# EAGLE design BT USB All SMD (EAGLE 7.6.0)
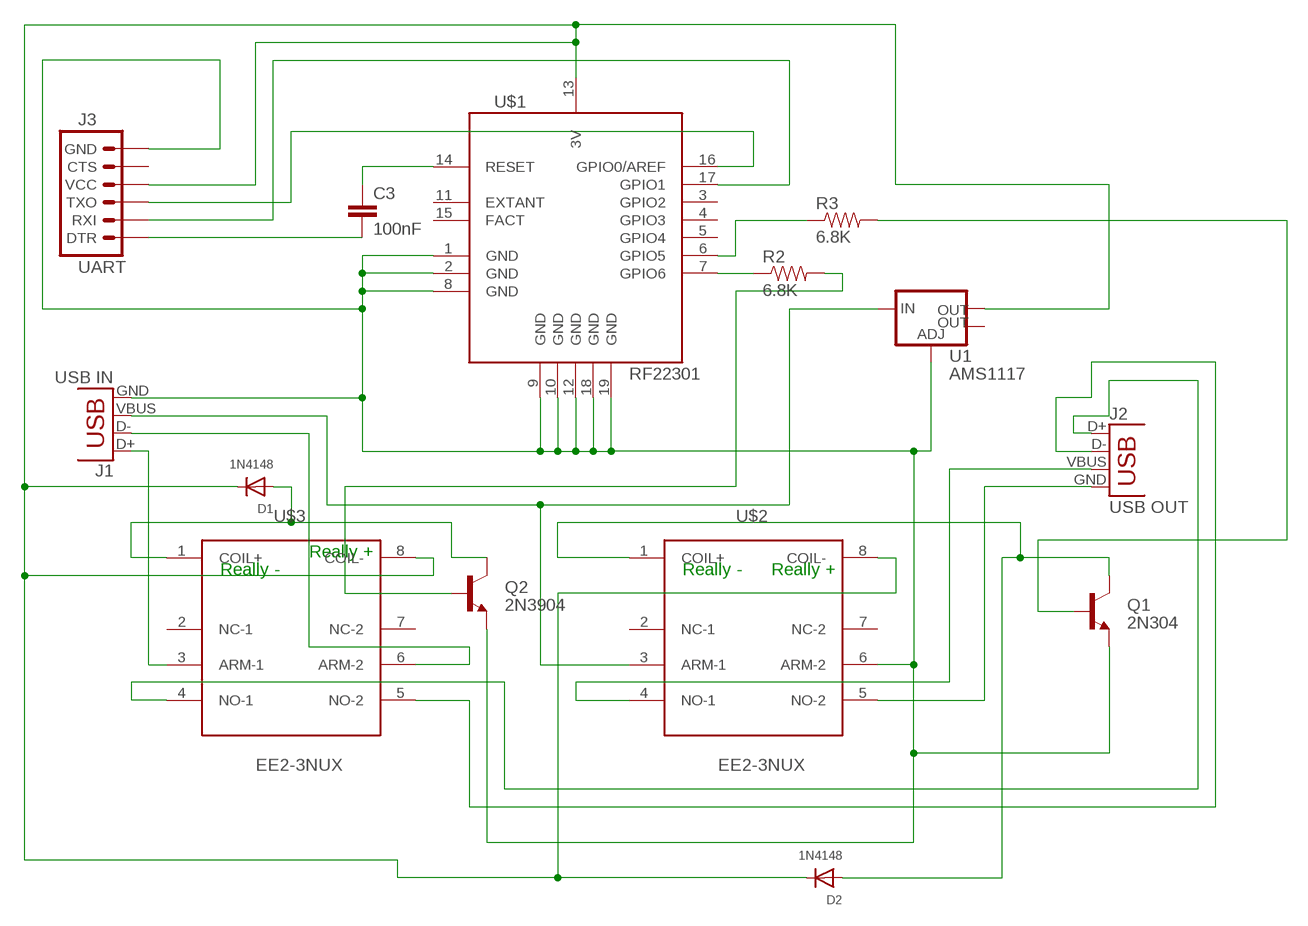
[diagram p0: schematic, sheet 1]

## Parts
C3  100nF  CAP0805  [0805]
D1  1N4148  DIODESOD-123  [SOD-123]
D2  1N4148  DIODESOD-123  [SOD-123]
J1  USB IN  USB-A-H  [USB-A-H]
J2  USB OUT  USB-A-S  [USB-A-S]
J3  UART  ARDUINO_SERIAL_PROGRAMPTH  [1X06]
Q1  2N304  TRANSISTOR_NPNMMBT5088  [SOT23-3]
Q2  2N3904  TRANSISTOR_NPNMMBT5088  [SOT23-3]
R2  6.8K  RESISTOR0805-RES  [0805]
R3  6.8K  RESISTOR0805-RES  [0805]
U1  AMS1117  V_REG_LM1117SOT223  [SOT223]
U$1  RF22301  [RFD22301]
U$2  RELAY-EE2-3NUX  [RELAY-EE2-3NUX]
U$3  RELAY-EE2-3NUX  [RELAY-EE2-3NUX]

## Nets
D_HIGH: J1.D+ U$3.3(ARM-1)
D_HIGH_OUT: J2.D+ U$3.4(NO-1)
D_LOW: J1.D- U$3.6(ARM-2)
D_LOW_OUT: J2.D- U$3.5(NO-2)
GND: J1.GND J3.6(GND) Q1.2(E) Q2.2(E) U1.1(ADJ) U$1.1(GND) U$1.2(GND) U$1.8(GND) U$1.9(GND) U$1.10(GND) U$1.12(GND) U$1.18(GND) U$1.19(GND) U$2.6(ARM-2)
GND_OUT: J2.GND U$2.5(NO-2)
N$1: D1.A Q2.3(C) U$3.1(COIL+)
N$2: D2.A Q1.3(C) U$2.1(COIL+)
N$10: C3.1 U$1.14(RESET)
N$11: C3.2 J3.1(DTR)
N$12: J3.3(TXO) U$1.16(GPIO0/AREF)
N$13: J3.2(RXI) U$1.17(GPIO1)
N$15: Q2.1(B) R2.2
N$16: R2.1 U$1.7(GPIO6)
N$17: R3.1 U$1.6(GPIO5)
N$18: Q1.1(B) R3.2
V3_3: D1.C D2.C J3.4(VCC) U1.2(OUT) U$1.13(3V) U$2.8(COIL-) U$3.8(COIL-)
V5_0: J1.VBUS U1.3(IN) U$2.3(ARM-1)
V5_0_OUT: J2.VBUS U$2.4(NO-1)
Unconnected: J3.5(CTS) U1.4(OUT) U$1.3(GPIO2) U$1.4(GPIO3) U$1.5(GPIO4) U$1.11(EXTANT) U$1.15(FACT) U$2.2(NC-1) U$2.7(NC-2) U$3.2(NC-1) U$3.7(NC-2)

## Notes on the sheet
- Really +
- Really - | Really - | Really +

## Library data of the parts
C3 = SparkFun-Capacitors:CAP: Capacitor Standard 0603 ceramic capacitor, and 0.1" leaded capacitor.
D1 D2 = adafruit:DIODE: Diode SMADIODE - SMA Surface Mount Package 20V 1A Schottky Diode Digikey: 641-1014-6-ND DO-1N4148 - Through Hole Small Current Diode SOD-123 20V 1 A (.5mV Vf) Schottky Diode - Digikey: MBRX120TPMSCT-ND SOD-323 10V 570mA (.38mV Vf, 3ns) Schottky Diode - Digikey: ZLLS410CT-ND SOD-523 30V 30mA Schottky Diode (RB751S-40TE61) - Digikey: RB751S-40TE61CT-ND SOT23-R/W - SOT23 Package (R = Solder Paste/Reflow Ovens, W = Hand-Soldering) BAT54Film 40V 300mA - Digikey: 497-7162-1-ND
J1 = SparkFun-Connectors:USB: USB Connectors USB-B-PTH is fully proven SKU : PRT-00139/CONN-08278 USB-miniB is fully proven SKU : PRT-00587 USB-A-PCB is untested. USB-A-H is throughly reviewed, but untested. Spark Fun Electronics SKU : PRT-00437 USB-B-SMT is throughly reviewed, but untested. Needs silkscreen touching up. USB-A-S has not been used/tested USB-MB-H has not been used/tested USB-MICROB has been used. CONN-09505; PROD_ID: CONN-08367
J2 = SparkFun-Connectors:USB: USB Connectors USB-B-PTH is fully proven SKU : PRT-00139/CONN-08278 USB-miniB is fully proven SKU : PRT-00587 USB-A-PCB is untested. USB-A-H is throughly reviewed, but untested. Spark Fun Electronics SKU : PRT-00437 USB-B-SMT is throughly reviewed, but untested. Needs silkscreen touching up. USB-A-S has not been used/tested USB-MB-H has not been used/tested USB-MICROB has been used. CONN-09505
J3 = SparkFun-Connectors:ARDUINO_SERIAL_PROGRAM: FTDI connector footprints
Q1 Q2 = SparkFun-DiscreteSemi:TRANSISTOR_NPN: Generic NPN BJT MMBT2222A - TRANS-08049 (SOT-23, 1A 40V) MPSA42 - TRANS-09116 (SOT-23, 500mA 300V) MMBT5088LT1G - TRANS-11160 (SOT-23, 50 mA 30V) BC547 - COM-08928 <http://www.sparkfun.com/products/8928> (TO-92 45V 100mA) (1.Collector 2.Base 3.Emitter) 2N3904 - COM-00521 <http://www.sparkfun.com/products/521> (TO-92 40V 200mA) (1.Emitter 2.Base 3.Collector) P2N2222A - COM-12852 <http://www.sparkfun.com/products/12852> (TO-92 40V 600mA) (1.Collector 2.Base 3.Emitter); PROD_ID: TRANS-11160; VALUE: MMBT5088
R2 = SparkFun-Resistors:RESISTOR: Resistor Basic schematic elements and footprints for 0603, 1206, and PTH resistors.
R3 = SparkFun-Passives:RESISTOR: Resistor Basic schematic elements and footprints for 0603, 1206, and PTH resistors.
U1 = SparkFun-PowerIC:V_REG_LM1117: Voltage Regulator LM1117 Standard adjustable voltage regulator but in SMD form. Spark Fun Electronics SKU : COM-00595; PROD_ID: VREG-08170
U$1 = GeekAmmo:RF22301: RFD22301 RFDuino Bluetooth 4.0 Low Energy BLE RF Module With Built-In ARM Cortex M0 Microconroller Hi performance, professional grade Bluetooth 4.0 Low Energy radio transceiver with built-in ARM Cortex M0 microcontroller that can be programmed using the simple-to-use Arduino IDE using RFduino extensions. Built-in user application microcontroller with ADC, I2C, SPI, UART and GPIO. http://www.rfduino.com/
U$2 U$3 = relay-ee2-3nux:RELAY-EE2-3NUX: DESCRIPTION NEC TOKIN EC2/EE2 relay is a standard miniature signal relay, compact and slim. FEATURES □Compact and light weight □FCC (1500 V) and Telcordia (2500 V) surge capacity □UL recognized and CSA certiﬁ ed. □Low power consumption (100-200 mW) □ND type (High insulation) conform to supplement insulation for EN60950 □NKX type (High breakdown voltage) can withstand 1.5KVAC at open contacts APPLICATIONS Electronic switching systems, PBX, Terminal equipment, Telephone system

## Board
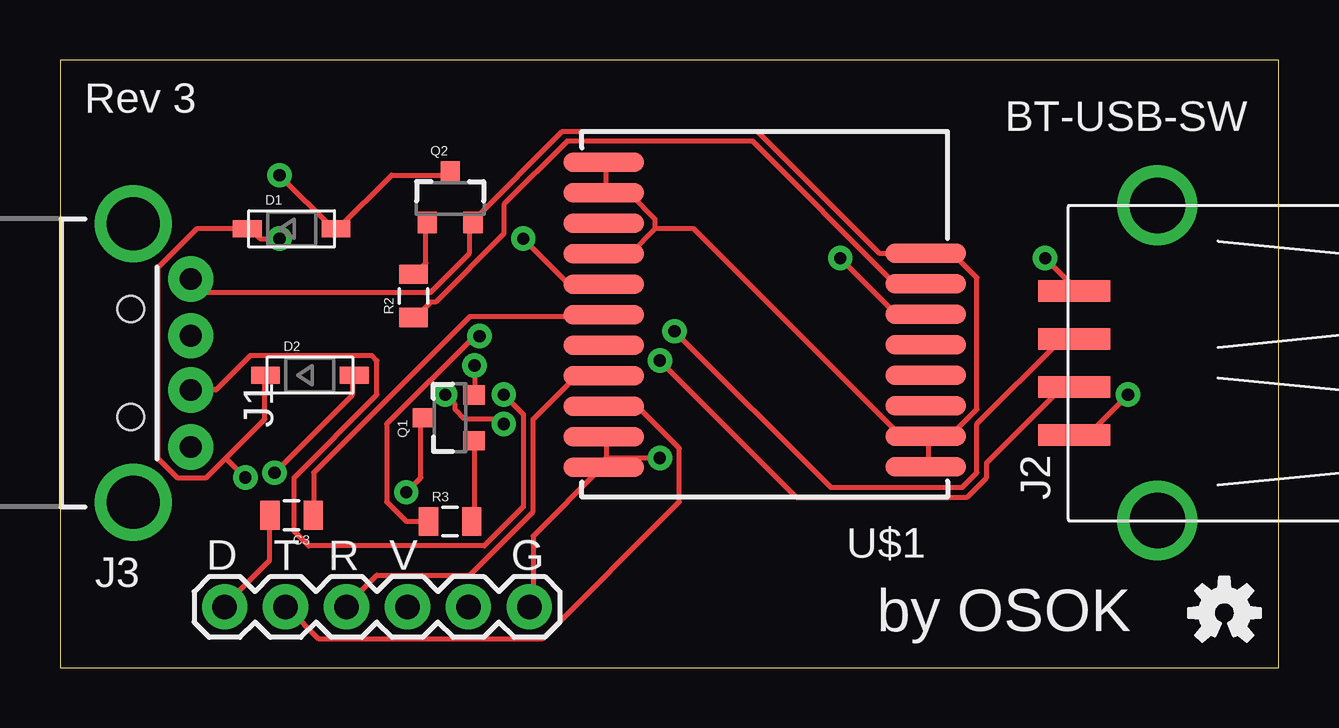
[diagram p1: board, top side]
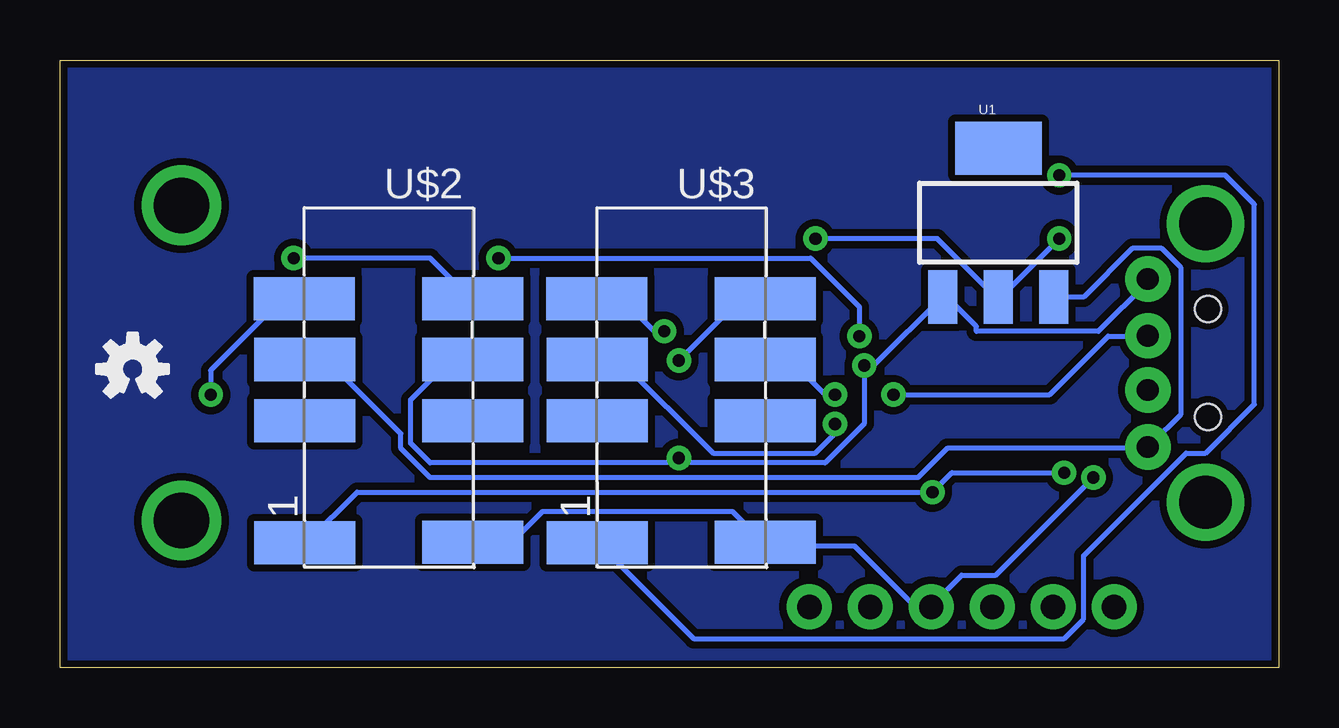
[diagram p2: board, bottom side, seen from below]

Size 50.78 x 25.32 mm. Coordinates in mm from the lower left corner, seen from the top.
Outline: 0,0 50.78,0 50.78,25.32 0,25.32 0,0
Copper layers (1*16): Top 0.035mm / dielectric 1.5mm / Bottom 0.035mm
Design rules "SparkFun": minimum track width 8mil, minimum drill 20mil, track to track 8mil, track to pad 8mil, pad to pad 8mil, via to via 8mil, smd to smd 8mil, copper to edge 10mil, drill to drill 8mil, minimum pad ring 12mil, minimum via ring 10mil, stop-mask expansion 4mil, vias tented up to drill 25mil, thermal gap 10mil

### Footprints (pad centres in the part's own frame; a part is rotated, then mirrored left to right if it is on the bottom)
0805 = smd 0.8 x 1.2: 1 -0.9,0; 2 0.9,0
SOD-123 = smd 1.2 x 0.7: A 1.85,0; C -1.85,0
USB-A-H = drill 0.914 pad 1.88: D+ 2.4,1.127; D- 2.4,-1.127; GND 2.4,3.5; VBUS 2.4,-3.5 | drill 2.2: GND2 0,-5.8; GND3 0,5.8 | hole 1.1: -0.1,2.25; -0.1,-2.25
USB-A-S = smd 3 x 0.9: D+ 3.45,-1; D- 3.45,1; GND 3.45,-3; VBUS 3.45,3 | drill 2.311: P$5 0,-6.566; P$6 0,6.566
1X06 = drill 1.016 pad 1.88: 1 0,0; 2 2.54,0; 3 5.08,0; 4 7.62,0; 5 10.16,0; 6 12.7,0
SOT23-3 = smd 0.8 x 0.9: 1 -0.95,-1; 2 0.95,-1; 3 0,1.1
SOT223 = smd 1.219 x 2.235: 1 -2.311,-3.099; 2 0,-3.099; 3 2.311,-3.099 | smd 3.6 x 2.2: 4 0,3.099
RFD22301 = smd 3.353 x 0.813: 1 0,0; 2 0,-1.27; 3 0,-2.54; 4 0,-3.81; 5 0,-5.08; 6 0,-6.35; 7 0,-7.62; 8 0,-8.89; 9 13.411,-12.675; 10 13.411,-11.405; 11 13.411,-10.135; 12 13.411,-8.865; 13 13.411,-7.595; 14 13.411,-6.325; 15 13.411,-5.055; 16 13.411,-3.785; 17 13.411,-2.515; 18 13.411,-1.245; 19 13.411,0.025
RELAY-EE2-3NUX = smd 1.8 x 4.2: 1 -5.97,3.5; 2 -0.88,3.5; 3 1.67,3.5; 4 4.2,3.52; 5 4.2,-3.5; 6 1.67,-3.5; 7 -0.88,-3.5; 8 -5.94,-3.5

### Placement (x,y rotation side)
C3  9.65,6.35 180 top
D1  9.65,18.29 0 top
D2  10.41,12.19 0 top
J1  3.05,12.7 0 top
J2  45.72,12.7 180 top
J3  6.86,2.54 0 top
Q1  16.26,10.41 90 top
Q2  16.26,19.56 0 top
R2  14.73,15.49 90 top
R3  16.26,6.1 0 top
U1  11.68,18.54 0 bottom
U$1  36.07,8.38 180 top
U$2  37.08,11.18 90 bottom
U$3  24.89,11.18 90 bottom
U$4  [OSHW-LOGO-S]  48.51,2.29 0 top
U$5  [OSHW-LOGO-S]  47.75,12.45 0 bottom

### Tracks (layer width: path | path; a pad name or v marks a point on that pad's centre or on a via)
D_HIGH  (via drill 0.51)
  Top 0.203: v16.05,11.38 16.46,10.97 16.46,10.77 16.87,10.36 18.29,10.36 v18.49,10.16
  Bottom 0.203: v16.05,11.38 9.55,11.38 7.11,13.82 5.49,13.82 J1.D+ | v18.49,10.16 18.49,9.75 19.3,8.94 23.57,8.94 27.43,12.8 28.25,12.8 U$3.3
D_HIGH_OUT  (via drill 0.51)
  Top 0.203: v25.6,14.02 32.11,7.52 37.59,7.52 38.2,8.13 38.2,10.16 41.66,13.61 42.27,13.61 J2.D+
  Bottom 0.203: v25.6,14.02 26.01,14.02 27.23,15.24 28.25,15.24 U$3.4
D_LOW  (via drill 0.51)
  Top 0.203: v18.49,11.38 19.3,10.57 19.3,6.71 17.68,5.08 10.36,5.08 9.75,5.69 9.75,7.92 13.21,11.38 13.21,12.8 13.01,13.01 7.92,13.01 6.5,11.58 5.49,11.58 J1.D-
  Bottom 0.203: v18.49,11.38 18.9,11.38 20.32,12.8 21.34,12.8 U$3.6
D_LOW_OUT  (via drill 0.51)
  Top 0.203: v24.99,12.8 30.68,7.11 37.8,7.11 38.61,7.92 38.61,8.53 41.66,11.58 42.27,11.58 J2.D-
  Bottom 0.203: v24.99,12.8 22.55,15.24 21.54,15.24 U$3.5
GND  (via drill 0.51)
  Top 0.203: 24.79,18.29 23.77,17.27 22.76,17.27 U$1.12 | 24.79,18.29 24.79,18.69 23.77,19.71 22.76,19.71 U$1.10 22.76,19.91 22.76,20.93 U$1.9 | U$1.1 36.17,8.53 36.17,9.55 U$1.2 | U$1.2 36.17,9.75 37.19,9.75 38.2,10.77 38.2,16.26 37.19,17.27 U$1.8 34.14,17.27 29.06,22.35 20.93,22.35 17.27,18.69 Q2.2 17.07,18.49 17.07,17.27 15.44,15.65 5.89,15.65 5.49,16.05 J1.GND | 24.79,18.29 26.42,18.29 34.95,9.75 35.97,9.75 U$1.2 | 22.76,8.74 22.76,9.55 U$1.18 | 22.76,8.74 22.76,8.53 U$1.19 | J3.6 19.71,2.64 19.71,5.49 22.55,8.33 U$1.19 | v17.27,12.6 17.27,11.38 Q1.2 | v24.99,8.74 22.76,8.74 | 22.76,8.74 U$1.19
  Bottom 0.203: J1.GND 5.49,16.05 7.52,14.02 12.6,14.02 12.6,14.22 13.82,15.44 U1.1 14.02,15.44 16.87,12.6 v17.27,12.6 17.27,10.16 18.9,8.53 24.99,8.53 | 24.99,8.53 35.36,8.53 36.17,9.35 36.17,11.18 34.54,12.8 33.73,12.8 U$2.6 | 24.99,8.53 v24.99,8.74
GND_OUT  (via drill 0.51)
  Top 0.203: v41.05,17.07 42.27,15.85 J2.GND
  Bottom 0.203: v41.05,17.07 35.36,17.07 33.73,15.44 U$2.5
N$1  (via drill 0.51)
  Top 0.203: Q2.3 16.26,20.52 13.82,20.52 11.58,18.29 D1.A 11.38,18.29 v9.14,20.52
  Bottom 0.203: v9.14,20.52 2.23,20.52 1.02,19.3 1.02,10.97 3.05,8.94 3.86,8.94 8.13,4.67 8.13,2.03 8.94,1.22 24.38,1.22 28.25,5.08 U$3.1
N$2  (via drill 0.51)
  Top 0.203: v14.43,7.32 15.04,7.92 15.04,10.36 Q1.3 | v8.94,8.13 12.19,11.38 12.19,12.19 D2.A
  Bottom 0.203: U$2.1 40.44,5.28 38.41,7.32 v14.43,7.32 13.61,8.13 v8.94,8.13
N$10
  Top 0.203: C3.1 10.57,6.5 10.57,8.13 17.07,14.63 22.55,14.63 U$1.14
N$11
  Top 0.203: C3.2 8.74,6.3 8.74,4.47 6.91,2.64 J3.1
N$12
  Top 0.203: U$1.16 22.55,11.99 21.34,11.99 19.71,10.36 19.71,6.5 17.07,3.86 13.21,3.86 11.99,2.64 J3.3
N$13
  Top 0.203: U$1.17 22.76,10.77 24.18,10.77 25.81,9.14 25.81,6.91 20.12,1.22 10.77,1.22 9.55,2.44 J3.2
N$15
  Top 0.203: Q2.1 15.24,18.49 15.24,16.87 14.83,16.46 R2.2
N$16
  Top 0.203: R2.1 14.83,14.63 15.44,15.24 15.65,15.24 18.49,18.09 18.49,19.3 21.13,21.95 28.85,21.95 34.75,16.05 35.97,16.05 U$1.7
N$17  (via drill 0.51)
  Top 0.203: R3.1 14.43,6.1 13.61,6.91 13.61,10.16 17.27,13.82 v17.48,13.82 | v32.51,17.07 34.75,14.83 35.97,14.83 U$1.6
  Bottom 0.203: v17.48,13.82 17.48,15.04 19.51,17.07 v32.51,17.07
N$18
  Top 0.203: Q1.1 17.27,9.35 17.27,6.1 R3.2
N$23
  pour Bottom (isolate 0.305): 0.25,25.15 50.55,25.15 50.55,0.25 0.25,0.25
V3_3  (via drill 0.51)
  Top 0.203: 6.91,8.74 6.1,7.92 4.88,7.92 4.06,8.74 4.06,16.66 5.69,18.29 D1.C 7.92,18.29 8.33,17.88 v9.14,17.88 | 6.91,8.74 8.53,10.36 8.53,12.19 D2.C | v19.3,17.88 21.13,16.05 22.55,16.05 U$1.13 | v7.72,7.92 6.91,8.74
  Bottom 0.203: v9.14,17.88 11.58,15.44 U1.2 11.79,15.44 14.22,17.88 v19.3,17.88 | U$2.8 33.53,5.28 31.9,5.28 30.68,6.5 22.76,6.5 21.54,5.28 U$3.8 21.34,5.08 17.68,5.08 15.24,2.64 14.63,2.64 J3.4 14.43,2.64 13.21,3.86 11.79,3.86 v7.72,7.92
V5_0
  Bottom 0.203: U1.3 8.13,15.44 6.1,17.48 4.88,17.48 4.06,16.66 4.06,10.57 5.28,9.35 J1.VBUS 5.49,9.14 13.82,9.14 15.04,7.92 35.36,7.92 36.58,9.14 36.58,9.75 39.62,12.8 40.44,12.8 U$2.3
V5_0_OUT  (via drill 0.51)
  Top 0.203: v44.5,11.38 42.88,9.75 42.47,9.75 J2.VBUS
  Bottom 0.203: v44.5,11.38 44.5,12.39 41.66,15.24 40.64,15.24 U$2.4

### Text on the board
tPlace: Rev 3 | BT-USB-SW | by OSOK
tNames: D | T | R | V | G